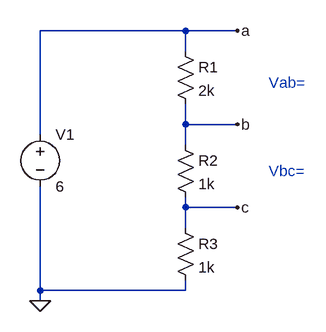
[diagram p0: schematic temp0.asc]
temp0.asc, the LTspice schematic file:
Version 4
SHEET 1 880 680
WIRE 304 0 80 0
WIRE 384 0 304 0
WIRE 304 32 304 0
WIRE 304 144 304 112
WIRE 384 144 304 144
WIRE 80 160 80 0
WIRE 304 176 304 144
WIRE 304 272 304 256
WIRE 384 272 304 272
WIRE 304 304 304 272
WIRE 80 400 80 240
WIRE 304 400 304 384
WIRE 304 400 80 400
WIRE 80 416 80 400
FLAG 80 416 0
FLAG 384 0 a
FLAG 384 144 b
FLAG 384 272 c
SYMBOL voltage 80 144 R0
WINDOW 123 0 0 Left 0
WINDOW 39 0 0 Left 0
SYMATTR InstName V1
SYMATTR Value 6
SYMBOL res 288 16 R0
SYMATTR InstName R1
SYMATTR Value 2k
SYMBOL res 288 160 R0
SYMATTR InstName R2
SYMATTR Value 1k
SYMBOL res 288 288 R0
SYMATTR InstName R3
SYMATTR Value 1k
TEXT 432 80 Left 2 ;Vab=
TEXT 432 216 Left 2 ;Vbc=

The netlist it stands for:
* temp0.asc
V1 a 0 6
R1 a b 2k
R2 b c 1k
R3 c 0 1k
* Vab=
* Vbc=
.backanno
.end